# EAGLE schematic TOP_SENSOR_V2 (EAGLE 6.4)
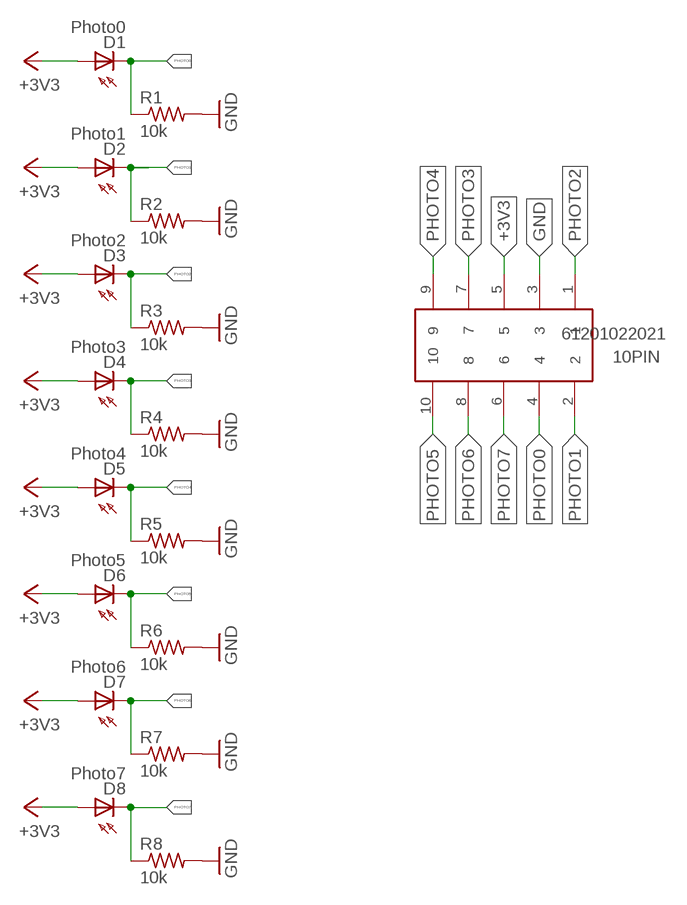
[diagram p0: schematic, sheet 1]

## Parts
10PIN  61201022021  [61201022021]
D1  Photo0  BPX65  [BPX65]
D2  Photo1  BPX65  [BPX65]
D3  Photo2  BPX65  [BPX65]
D4  Photo3  BPX65  [BPX65]
D5  Photo4  BPX65  [BPX65]
D6  Photo5  BPX65  [BPX65]
D7  Photo6  BPX65  [BPX65]
D8  Photo7  BPX65  [BPX65]
R1  10k  R-US_0207/10  [0207/10]
R2  10k  R-US_0207/10  [0207/10]
R3  10k  R-US_0207/10  [0207/10]
R4  10k  R-US_0207/10  [0207/10]
R5  10k  R-US_0207/10  [0207/10]
R6  10k  R-US_0207/10  [0207/10]
R7  10k  R-US_0207/10  [0207/10]
R8  10k  R-US_0207/10  [0207/10]

## Nets
+3V3: 10PIN.5 D1.A D2.A D3.A D4.A D5.A D6.A D7.A D8.A
GND: 10PIN.3 R1.2 R2.2 R3.2 R4.2 R5.2 R6.2 R7.2 R8.2
PHOTO0: 10PIN.4 D1.K(C) R1.1
PHOTO1: 10PIN.2 D2.K(C) R2.1
PHOTO2: 10PIN.1 D3.K(C) R3.1
PHOTO3: 10PIN.7 D4.K(C) R4.1
PHOTO4: 10PIN.9 D5.K(C) R5.1
PHOTO5: 10PIN.10 D6.K(C) R6.1
PHOTO6: 10PIN.8 D7.K(C) R7.1
PHOTO7: 10PIN.6 D8.K(C) R8.1

## Library data of the parts
10PIN = Wuerth_Elektronik_eiCan_05_Box_Header_IDC_Connectors_1_2:61201022021: WR-BHD 2.54mm Male Box Header With Lever, 10 Pins
D1-D8 = opto-trans-siemens:BPX65: PHOTO DIODE; MPN: BPX65.; OC_FARNELL: 327451; OC_NEWARK: 06WX2764
R1-R8 = resistor:R-US_: RESISTOR, American symbol